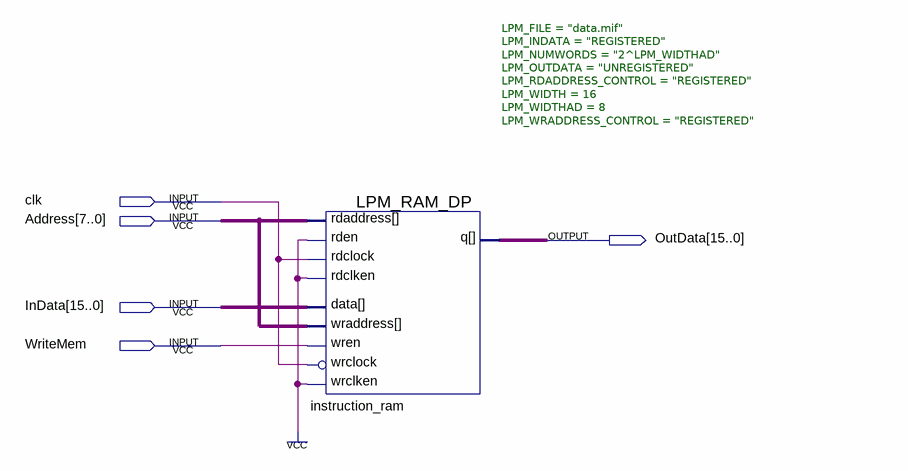
[diagram p0: schematic sheet]
// Quartus schematic instruction_ram.bdf as structural Verilog: 1 symbols, 5 pins
module instruction_ram (
  input  clk,
  input  [7:0] Address,
  input  [15:0] InData,
  input  WriteMem,
  output [15:0] OutData
);

  LPM_RAM_DP #(.LPM_FILE("data.mif"), .LPM_INDATA("REGISTERED"), .LPM_NUMWORDS("2^LPM_WIDTHAD"), .LPM_OUTDATA("UNREGISTERED"), .LPM_RDADDRESS_CONTROL("REGISTERED"), .LPM_WIDTH(16), .LPM_WIDTHAD(8), .LPM_WRADDRESS_CONTROL("REGISTERED")) instruction_ram (
    .data(InData), .rdaddress(Address), .rdclken(1'b1), .rdclock(clk), .rden(1'b1), .wraddress(Address),
    .wrclken(1'b1), .wrclock(~clk), .wren(WriteMem), .q(OutData));
endmodule
